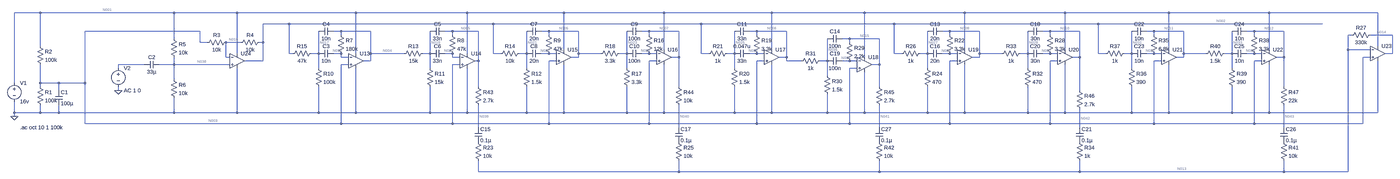
[diagram p0: schematic Implemented_Equalizer.asc, whole sheet]
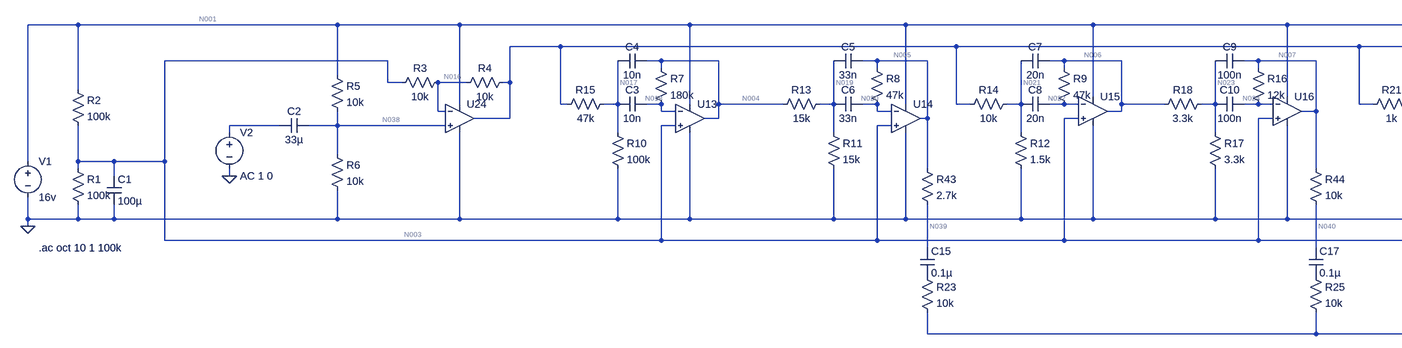
[diagram p1: schematic Implemented_Equalizer.asc, part, row 1 of 1, column 1 of 2]
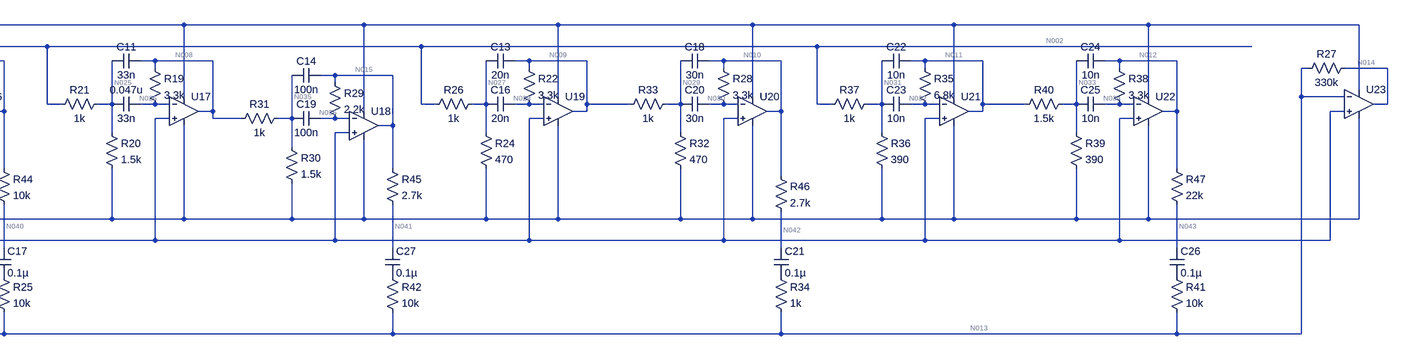
[diagram p2: schematic Implemented_Equalizer.asc, part, row 1 of 1, column 2 of 2]
Implemented_Equalizer.asc, the LTspice schematic file:
Version 4
SHEET 1 5168 1268
WIRE -912 -176 -1024 -176
WIRE -336 -176 -912 -176
WIRE -64 -176 -336 -176
WIRE 448 -176 -64 -176
WIRE 928 -176 448 -176
WIRE 1344 -176 928 -176
WIRE 1776 -176 1344 -176
WIRE 2240 -176 1776 -176
WIRE 2640 -176 2240 -176
WIRE 3072 -176 2640 -176
WIRE 3504 -176 3072 -176
WIRE 3952 -176 3504 -176
WIRE 4384 -176 3952 -176
WIRE 4944 -176 4384 -176
WIRE 160 -128 48 -128
WIRE 1040 -128 160 -128
WIRE 1936 -128 1040 -128
WIRE 2768 -128 1936 -128
WIRE 3648 -128 2768 -128
WIRE 4704 -128 3648 -128
WIRE -224 -96 -720 -96
WIRE 384 -96 352 -96
WIRE 512 -96 384 -96
WIRE 864 -96 832 -96
WIRE 976 -96 864 -96
WIRE 1280 -96 1248 -96
WIRE 1408 -96 1280 -96
WIRE 1712 -96 1680 -96
WIRE 1840 -96 1712 -96
WIRE 2176 -96 2144 -96
WIRE 2304 -96 2176 -96
WIRE 3008 -96 2976 -96
WIRE 3136 -96 3008 -96
WIRE 3440 -96 3408 -96
WIRE 3568 -96 3440 -96
WIRE 3888 -96 3856 -96
WIRE 4016 -96 3888 -96
WIRE 4320 -96 4288 -96
WIRE 4448 -96 4320 -96
WIRE 384 -80 384 -96
WIRE 864 -80 864 -96
WIRE 1280 -80 1280 -96
WIRE 1712 -80 1712 -96
WIRE 2176 -80 2176 -96
WIRE 3008 -80 3008 -96
WIRE 3440 -80 3440 -96
WIRE 3888 -80 3888 -96
WIRE 4320 -80 4320 -96
WIRE 4832 -80 4816 -80
WIRE 5008 -80 4912 -80
WIRE -336 -64 -336 -176
WIRE 2576 -64 2544 -64
WIRE 2704 -64 2576 -64
WIRE -224 -48 -224 -96
WIRE -192 -48 -224 -48
WIRE -48 -48 -112 -48
WIRE 48 -48 48 -128
WIRE 48 -48 32 -48
WIRE 2576 -48 2576 -64
WIRE -912 -32 -912 -176
WIRE 4944 -32 4944 -176
WIRE 1344 -16 1344 -176
WIRE 1776 -16 1776 -176
WIRE 2240 -16 2240 -176
WIRE 3072 -16 3072 -176
WIRE 3504 -16 3504 -176
WIRE 3952 -16 3952 -176
WIRE 4384 -16 4384 -176
WIRE 4816 -16 4816 -80
WIRE 4912 -16 4816 -16
WIRE -64 0 -64 -176
WIRE 160 0 160 -128
WIRE 176 0 160 0
WIRE 288 0 288 -96
WIRE 288 0 256 0
WIRE 384 0 352 0
WIRE 448 0 448 -176
WIRE 512 0 512 -96
WIRE 656 0 512 0
WIRE 768 0 768 -96
WIRE 768 0 736 0
WIRE 864 0 832 0
WIRE 928 0 928 -176
WIRE 1040 0 1040 -128
WIRE 1072 0 1040 0
WIRE 1184 0 1184 -96
WIRE 1184 0 1152 0
WIRE 1280 0 1248 0
WIRE 1312 0 1280 0
WIRE 1408 0 1408 -96
WIRE 1504 0 1408 0
WIRE 1616 0 1616 -96
WIRE 1616 0 1584 0
WIRE 1712 0 1680 0
WIRE 1744 0 1712 0
WIRE 1936 0 1936 -128
WIRE 1968 0 1936 0
WIRE 2080 0 2080 -96
WIRE 2080 0 2048 0
WIRE 2176 0 2144 0
WIRE 2208 0 2176 0
WIRE 2768 0 2768 -128
WIRE 2800 0 2768 0
WIRE 2912 0 2912 -96
WIRE 2912 0 2880 0
WIRE 3008 0 2976 0
WIRE 3040 0 3008 0
WIRE 3136 0 3136 -96
WIRE 3232 0 3136 0
WIRE 3344 0 3344 -96
WIRE 3344 0 3312 0
WIRE 3440 0 3408 0
WIRE 3472 0 3440 0
WIRE 3648 0 3648 -128
WIRE 3680 0 3648 0
WIRE 3792 0 3792 -96
WIRE 3792 0 3760 0
WIRE 3888 0 3856 0
WIRE 3920 0 3888 0
WIRE 4016 0 4016 -96
WIRE 4112 0 4016 0
WIRE 4224 0 4224 -96
WIRE 4224 0 4192 0
WIRE 4320 0 4288 0
WIRE 4352 0 4320 0
WIRE 5008 0 5008 -80
WIRE 5008 0 4976 0
WIRE -112 16 -112 -48
WIRE -96 16 -112 16
WIRE 384 16 384 0
WIRE 416 16 384 16
WIRE 864 16 864 0
WIRE 896 16 864 16
WIRE 1408 16 1408 0
WIRE 1408 16 1376 16
WIRE 1840 16 1840 -96
WIRE 1840 16 1808 16
WIRE 2304 16 2304 -96
WIRE 2304 16 2272 16
WIRE 2640 16 2640 -176
WIRE 3136 16 3136 0
WIRE 3136 16 3104 16
WIRE 3568 16 3568 -96
WIRE 3568 16 3536 16
WIRE 4016 16 4016 0
WIRE 4016 16 3984 16
WIRE 4448 16 4448 -96
WIRE 4448 16 4416 16
WIRE 4912 16 4880 16
WIRE 48 32 48 -48
WIRE 48 32 -32 32
WIRE 512 32 512 0
WIRE 512 32 480 32
WIRE 976 32 976 -96
WIRE 976 32 960 32
WIRE 1312 32 1280 32
WIRE 1744 32 1712 32
WIRE 2208 32 2176 32
WIRE 2304 32 2304 16
WIRE 2368 32 2304 32
WIRE 2480 32 2480 -64
WIRE 2480 32 2448 32
WIRE 2576 32 2544 32
WIRE 2608 32 2576 32
WIRE 3040 32 3008 32
WIRE 3472 32 3440 32
WIRE 3920 32 3888 32
WIRE 4352 32 4320 32
WIRE -464 48 -576 48
WIRE -336 48 -336 16
WIRE -336 48 -400 48
WIRE -96 48 -336 48
WIRE 416 48 384 48
WIRE 896 48 864 48
WIRE 2704 48 2704 -64
WIRE 2704 48 2672 48
WIRE -576 64 -576 48
WIRE 288 64 288 0
WIRE 768 64 768 0
WIRE 1184 64 1184 0
WIRE 1616 64 1616 0
WIRE 2080 64 2080 0
WIRE 2608 64 2576 64
WIRE 2912 64 2912 0
WIRE 3344 64 3344 0
WIRE 3792 64 3792 0
WIRE 4224 64 4224 0
WIRE 2480 96 2480 32
WIRE -336 112 -336 48
WIRE -1024 128 -1024 -176
WIRE -912 128 -912 48
WIRE -832 128 -912 128
WIRE -720 128 -720 -96
WIRE -720 128 -832 128
WIRE -912 144 -912 128
WIRE 976 144 976 32
WIRE 1840 144 1840 16
WIRE 2704 144 2704 48
WIRE 4448 144 4448 16
WIRE -832 160 -832 128
WIRE -576 160 -576 144
WIRE 3568 160 3568 16
WIRE -1024 256 -1024 208
WIRE -912 256 -912 224
WIRE -912 256 -1024 256
WIRE -832 256 -832 224
WIRE -832 256 -912 256
WIRE -336 256 -336 192
WIRE -336 256 -832 256
WIRE -64 256 -64 64
WIRE -64 256 -336 256
WIRE 288 256 288 144
WIRE 288 256 -64 256
WIRE 448 256 448 64
WIRE 448 256 288 256
WIRE 768 256 768 144
WIRE 768 256 448 256
WIRE 928 256 928 64
WIRE 928 256 768 256
WIRE 1184 256 1184 144
WIRE 1184 256 928 256
WIRE 1344 256 1344 48
WIRE 1344 256 1184 256
WIRE 1616 256 1616 144
WIRE 1616 256 1344 256
WIRE 1776 256 1776 48
WIRE 1776 256 1616 256
WIRE 2080 256 2080 144
WIRE 2080 256 1776 256
WIRE 2240 256 2240 48
WIRE 2240 256 2080 256
WIRE 2480 256 2480 176
WIRE 2480 256 2240 256
WIRE 2640 256 2640 80
WIRE 2640 256 2480 256
WIRE 2912 256 2912 144
WIRE 2912 256 2640 256
WIRE 3072 256 3072 48
WIRE 3072 256 2912 256
WIRE 3344 256 3344 144
WIRE 3344 256 3072 256
WIRE 3504 256 3504 48
WIRE 3504 256 3344 256
WIRE 3792 256 3792 144
WIRE 3792 256 3504 256
WIRE 3952 256 3952 48
WIRE 3952 256 3792 256
WIRE 4224 256 4224 144
WIRE 4224 256 3952 256
WIRE 4384 256 4384 48
WIRE 4384 256 4224 256
WIRE 4944 256 4944 32
WIRE 4944 256 4384 256
WIRE -1024 272 -1024 256
WIRE -720 304 -720 128
WIRE 384 304 384 48
WIRE 384 304 -720 304
WIRE 864 304 864 48
WIRE 864 304 384 304
WIRE 1280 304 1280 32
WIRE 1280 304 864 304
WIRE 1712 304 1712 32
WIRE 1712 304 1280 304
WIRE 2176 304 2176 32
WIRE 2176 304 1712 304
WIRE 2576 304 2576 64
WIRE 2576 304 2176 304
WIRE 3008 304 3008 32
WIRE 3008 304 2576 304
WIRE 3440 304 3440 32
WIRE 3440 304 3008 304
WIRE 3888 304 3888 32
WIRE 3888 304 3440 304
WIRE 4320 304 4320 32
WIRE 4320 304 3888 304
WIRE 4880 304 4880 16
WIRE 4880 304 4320 304
WIRE 976 320 976 224
WIRE 1840 320 1840 224
WIRE 2704 320 2704 224
WIRE 3568 320 3568 240
WIRE 4448 320 4448 224
WIRE 976 512 976 464
WIRE 1840 512 1840 464
WIRE 1840 512 976 512
WIRE 2704 512 2704 464
WIRE 2704 512 1840 512
WIRE 3568 512 3568 464
WIRE 3568 512 2704 512
WIRE 4448 512 4448 464
WIRE 4448 512 3568 512
WIRE 4816 512 4816 -16
WIRE 4816 512 4448 512
FLAG -1024 272 0
FLAG -576 160 0
SYMBOL voltage -1024 112 R0
WINDOW 123 0 0 Left 0
WINDOW 39 0 0 Left 0
SYMATTR InstName V1
SYMATTR Value 16v
SYMBOL res -928 128 R0
SYMATTR InstName R1
SYMATTR Value 100k
SYMBOL res -928 -48 R0
SYMATTR InstName R2
SYMATTR Value 100k
SYMBOL cap -848 160 R0
SYMATTR InstName C1
SYMATTR Value 100µ
SYMBOL res -96 -64 R90
WINDOW 0 0 56 VBottom 2
WINDOW 3 32 56 VTop 2
SYMATTR InstName R3
SYMATTR Value 10k
SYMBOL res 48 -64 R90
WINDOW 0 0 56 VBottom 2
WINDOW 3 32 56 VTop 2
SYMATTR InstName R4
SYMATTR Value 10k
SYMBOL res -352 -80 R0
SYMATTR InstName R5
SYMATTR Value 10k
SYMBOL res -352 96 R0
SYMATTR InstName R6
SYMATTR Value 10k
SYMBOL cap -400 32 R90
WINDOW 0 0 32 VBottom 2
WINDOW 3 32 32 VTop 2
SYMATTR InstName C2
SYMATTR Value 33µ
SYMBOL voltage -576 48 R0
WINDOW 123 24 112 Left 2
WINDOW 39 0 0 Left 0
SYMATTR Value2 AC 1 0
SYMATTR InstName V2
SYMATTR Value ""
SYMBOL res 368 -96 R0
SYMATTR InstName R7
SYMATTR Value 180k
SYMBOL res 848 -96 R0
SYMATTR InstName R8
SYMATTR Value 47k
SYMBOL res 1264 -96 R0
SYMATTR InstName R9
SYMATTR Value 47k
SYMBOL cap 352 -16 R90
WINDOW 0 0 32 VBottom 2
WINDOW 3 32 32 VTop 2
SYMATTR InstName C3
SYMATTR Value 10n
SYMBOL cap 352 -112 R90
WINDOW 0 0 32 VBottom 2
WINDOW 3 32 32 VTop 2
SYMATTR InstName C4
SYMATTR Value 10n
SYMBOL cap 832 -112 R90
WINDOW 0 0 32 VBottom 2
WINDOW 3 32 32 VTop 2
SYMATTR InstName C5
SYMATTR Value 33n
SYMBOL cap 832 -16 R90
WINDOW 0 0 32 VBottom 2
WINDOW 3 32 32 VTop 2
SYMATTR InstName C6
SYMATTR Value 33n
SYMBOL cap 1248 -112 R90
WINDOW 0 0 32 VBottom 2
WINDOW 3 32 32 VTop 2
SYMATTR InstName C7
SYMATTR Value 20n
SYMBOL cap 1248 -16 R90
WINDOW 0 0 32 VBottom 2
WINDOW 3 32 32 VTop 2
SYMATTR InstName C8
SYMATTR Value 20n
SYMBOL res 272 48 R0
SYMATTR InstName R10
SYMATTR Value 100k
SYMBOL res 752 48 R0
SYMATTR InstName R11
SYMATTR Value 15k
SYMBOL res 1168 48 R0
SYMATTR InstName R12
SYMATTR Value 1.5k
SYMBOL res 752 -16 R90
WINDOW 0 0 56 VBottom 2
WINDOW 3 32 56 VTop 2
SYMATTR InstName R13
SYMATTR Value 15k
SYMBOL res 1168 -16 R90
WINDOW 0 0 56 VBottom 2
WINDOW 3 32 56 VTop 2
SYMATTR InstName R14
SYMATTR Value 10k
SYMBOL res 272 -16 R90
WINDOW 0 0 56 VBottom 2
WINDOW 3 32 56 VTop 2
SYMATTR InstName R15
SYMATTR Value 47k
SYMBOL res 1696 -96 R0
SYMATTR InstName R16
SYMATTR Value 12k
SYMBOL cap 1680 -112 R90
WINDOW 0 0 32 VBottom 2
WINDOW 3 32 32 VTop 2
SYMATTR InstName C9
SYMATTR Value 100n
SYMBOL cap 1680 -16 R90
WINDOW 0 0 32 VBottom 2
WINDOW 3 32 32 VTop 2
SYMATTR InstName C10
SYMATTR Value 100n
SYMBOL res 1600 48 R0
SYMATTR InstName R17
SYMATTR Value 3.3k
SYMBOL res 1600 -16 R90
WINDOW 0 0 56 VBottom 2
WINDOW 3 32 56 VTop 2
SYMATTR InstName R18
SYMATTR Value 3.3k
SYMBOL res 2160 -96 R0
SYMATTR InstName R19
SYMATTR Value 3.3k
SYMBOL cap 2144 -112 R90
WINDOW 0 0 32 VBottom 2
WINDOW 3 32 32 VTop 2
SYMATTR InstName C11
SYMATTR Value 33n
SYMBOL cap 2144 -16 R90
WINDOW 0 0 32 VBottom 2
WINDOW 3 32 32 VTop 2
SYMATTR InstName 0.047u
SYMATTR Value 33n
SYMBOL res 2064 48 R0
SYMATTR InstName R20
SYMATTR Value 1.5k
SYMBOL res 2064 -16 R90
WINDOW 0 0 56 VBottom 2
WINDOW 3 32 56 VTop 2
SYMATTR InstName R21
SYMATTR Value 1k
SYMBOL cap 960 320 R0
SYMATTR InstName C15
SYMATTR Value 0.1µ
SYMBOL cap 1824 320 R0
SYMATTR InstName C17
SYMATTR Value 0.1µ
SYMBOL res 960 368 R0
SYMATTR InstName R23
SYMATTR Value 10k
SYMBOL res 1824 368 R0
SYMATTR InstName R25
SYMATTR Value 10k
SYMBOL res 4928 -96 R90
WINDOW 0 0 56 VBottom 2
WINDOW 3 32 56 VTop 2
SYMATTR InstName R27
SYMATTR Value 330k
SYMBOL res 2560 -64 R0
SYMATTR InstName R29
SYMATTR Value 2.2k
SYMBOL cap 2544 -80 R90
WINDOW 0 0 32 VBottom 2
WINDOW 3 32 32 VTop 2
SYMATTR InstName C14
SYMATTR Value 100n
SYMBOL cap 2544 16 R90
WINDOW 0 0 32 VBottom 2
WINDOW 3 32 32 VTop 2
SYMATTR InstName C19
SYMATTR Value 100n
SYMBOL res 2464 80 R0
SYMATTR InstName R30
SYMATTR Value 1.5k
SYMBOL res 2464 16 R90
WINDOW 0 0 56 VBottom 2
WINDOW 3 32 56 VTop 2
SYMATTR InstName R31
SYMATTR Value 1k
SYMBOL res 2992 -96 R0
SYMATTR InstName R22
SYMATTR Value 3.3k
SYMBOL cap 2976 -112 R90
WINDOW 0 0 32 VBottom 2
WINDOW 3 32 32 VTop 2
SYMATTR InstName C13
SYMATTR Value 20n
SYMBOL cap 2976 -16 R90
WINDOW 0 0 32 VBottom 2
WINDOW 3 32 32 VTop 2
SYMATTR InstName C16
SYMATTR Value 20n
SYMBOL res 2896 48 R0
SYMATTR InstName R24
SYMATTR Value 470
SYMBOL res 2896 -16 R90
WINDOW 0 0 56 VBottom 2
WINDOW 3 32 56 VTop 2
SYMATTR InstName R26
SYMATTR Value 1k
SYMBOL res 3424 -96 R0
SYMATTR InstName R28
SYMATTR Value 3.3k
SYMBOL cap 3408 -112 R90
WINDOW 0 0 32 VBottom 2
WINDOW 3 32 32 VTop 2
SYMATTR InstName C18
SYMATTR Value 30n
SYMBOL cap 3408 -16 R90
WINDOW 0 0 32 VBottom 2
WINDOW 3 32 32 VTop 2
SYMATTR InstName C20
SYMATTR Value 30n
SYMBOL res 3328 48 R0
SYMATTR InstName R32
SYMATTR Value 470
SYMBOL res 3328 -16 R90
WINDOW 0 0 56 VBottom 2
WINDOW 3 32 56 VTop 2
SYMATTR InstName R33
SYMATTR Value 1k
SYMBOL cap 3552 320 R0
SYMATTR InstName C21
SYMATTR Value 0.1µ
SYMBOL res 3552 368 R0
SYMATTR InstName R34
SYMATTR Value 1k
SYMBOL res 3872 -96 R0
SYMATTR InstName R35
SYMATTR Value 6.8k
SYMBOL cap 3856 -112 R90
WINDOW 0 0 32 VBottom 2
WINDOW 3 32 32 VTop 2
SYMATTR InstName C22
SYMATTR Value 10n
SYMBOL cap 3856 -16 R90
WINDOW 0 0 32 VBottom 2
WINDOW 3 32 32 VTop 2
SYMATTR InstName C23
SYMATTR Value 10n
SYMBOL res 3776 48 R0
SYMATTR InstName R36
SYMATTR Value 390
SYMBOL res 3776 -16 R90
WINDOW 0 0 56 VBottom 2
WINDOW 3 32 56 VTop 2
SYMATTR InstName R37
SYMATTR Value 1k
SYMBOL res 4304 -96 R0
SYMATTR InstName R38
SYMATTR Value 3.3k
SYMBOL cap 4288 -112 R90
WINDOW 0 0 32 VBottom 2
WINDOW 3 32 32 VTop 2
SYMATTR InstName C24
SYMATTR Value 10n
SYMBOL cap 4288 -16 R90
WINDOW 0 0 32 VBottom 2
WINDOW 3 32 32 VTop 2
SYMATTR InstName C25
SYMATTR Value 10n
SYMBOL res 4208 48 R0
SYMATTR InstName R39
SYMATTR Value 390
SYMBOL res 4208 -16 R90
WINDOW 0 0 56 VBottom 2
WINDOW 3 32 56 VTop 2
SYMATTR InstName R40
SYMATTR Value 1.5k
SYMBOL cap 4432 320 R0
SYMATTR InstName C26
SYMATTR Value 0.1µ
SYMBOL res 4432 368 R0
SYMATTR InstName R41
SYMATTR Value 10k
SYMBOL cap 2688 320 R0
SYMATTR InstName C27
SYMATTR Value 0.1µ
SYMBOL res 2688 368 R0
SYMATTR InstName R42
SYMATTR Value 10k
SYMBOL OpAmps\\UniversalOpAmp 448 32 R0
SYMATTR InstName U13
SYMBOL OpAmps\\UniversalOpAmp 928 32 R0
SYMATTR InstName U14
SYMBOL OpAmps\\UniversalOpAmp 1344 16 R0
SYMATTR InstName U15
SYMBOL OpAmps\\UniversalOpAmp 1776 16 R0
SYMATTR InstName U16
SYMBOL OpAmps\\UniversalOpAmp 2240 16 R0
SYMATTR InstName U17
SYMBOL OpAmps\\UniversalOpAmp 2640 48 R0
SYMATTR InstName U18
SYMBOL OpAmps\\UniversalOpAmp 3072 16 R0
SYMATTR InstName U19
SYMBOL OpAmps\\UniversalOpAmp 3504 16 R0
SYMATTR InstName U20
SYMBOL OpAmps\\UniversalOpAmp 3952 16 R0
SYMATTR InstName U21
SYMBOL OpAmps\\UniversalOpAmp 4384 16 R0
SYMATTR InstName U22
SYMBOL OpAmps\\UniversalOpAmp 4944 0 R0
SYMATTR InstName U23
SYMBOL OpAmps\\UniversalOpAmp -64 32 R0
SYMATTR InstName U24
SYMBOL res 960 128 R0
SYMATTR InstName R43
SYMATTR Value 2.7k
SYMBOL res 1824 128 R0
SYMATTR InstName R44
SYMATTR Value 10k
SYMBOL res 2688 128 R0
SYMATTR InstName R45
SYMATTR Value 2.7k
SYMBOL res 3552 144 R0
SYMATTR InstName R46
SYMATTR Value 2.7k
SYMBOL res 4432 128 R0
SYMATTR InstName R47
SYMATTR Value 22k
TEXT -1000 320 Left 2 !.ac oct 10 1 100k

The netlist it stands for:
* Implemented_Equalizer.asc
V1 N001 0 16v
R1 N003 0 100k
R2 N001 N003 100k
C1 N003 0 100µ
R3 N016 N003 10k
R4 N002 N016 10k
R5 N001 N038 10k
R6 N038 0 10k
C2 N038 N037 33µ
V2 N037 0 AC 1 0
R7 N004 N018 180k
R8 N005 N020 47k
R9 N006 N022 47k
C3 N018 N017 10n
C4 N004 N017 10n
C5 N005 N019 33n
C6 N020 N019 33n
C7 N006 N021 20n
C8 N022 N021 20n
R10 N017 0 100k
R11 N019 0 15k
R12 N021 0 1.5k
R13 N019 N004 15k
R14 N021 N002 10k
R15 N017 N002 47k
R16 N007 N024 12k
C9 N007 N023 100n
C10 N024 N023 100n
R17 N023 0 3.3k
R18 N023 N006 3.3k
R19 N008 N026 3.3k
C11 N008 N025 33n
C§0.047u N026 N025 33n
R20 N025 0 1.5k
R21 N025 N002 1k
C15 N039 P001 0.1µ
C17 N040 P002 0.1µ
R23 P001 N013 10k
R25 P002 N013 10k
R27 N014 N013 330k
R29 N015 N036 2.2k
C14 N015 N035 100n
C19 N036 N035 100n
R30 N035 0 1.5k
R31 N035 N008 1k
R22 N009 N028 3.3k
C13 N009 N027 20n
C16 N028 N027 20n
R24 N027 0 470
R26 N027 N002 1k
R28 N010 N030 3.3k
C18 N010 N029 30n
C20 N030 N029 30n
R32 N029 0 470
R33 N029 N009 1k
C21 N042 P003 0.1µ
R34 P003 N013 1k
R35 N011 N032 6.8k
C22 N011 N031 10n
C23 N032 N031 10n
R36 N031 0 390
R37 N031 N002 1k
R38 N012 N034 3.3k
C24 N012 N033 10n
C25 N034 N033 10n
R39 N033 0 390
R40 N033 N011 1.5k
C26 N043 P004 0.1µ
R41 P004 N013 10k
C27 N041 P005 0.1µ
R42 P005 N013 10k
XU13 N003 N018 N001 0 N004 level1 Avol=1Meg GBW=10Meg Vos=0 En=0 Enk=0 In=0 Ink=0 Rin=500Meg  ; pins In+ In- V+ V- OUT
XU14 N003 N020 N001 0 N005 level1 Avol=1Meg GBW=10Meg Vos=0 En=0 Enk=0 In=0 Ink=0 Rin=500Meg  ; pins In+ In- V+ V- OUT
XU15 N003 N022 N001 0 N006 level1 Avol=1Meg GBW=10Meg Vos=0 En=0 Enk=0 In=0 Ink=0 Rin=500Meg  ; pins In+ In- V+ V- OUT
XU16 N003 N024 N001 0 N007 level1 Avol=1Meg GBW=10Meg Vos=0 En=0 Enk=0 In=0 Ink=0 Rin=500Meg  ; pins In+ In- V+ V- OUT
XU17 N003 N026 N001 0 N008 level1 Avol=1Meg GBW=10Meg Vos=0 En=0 Enk=0 In=0 Ink=0 Rin=500Meg  ; pins In+ In- V+ V- OUT
XU18 N003 N036 N001 0 N015 level1 Avol=1Meg GBW=10Meg Vos=0 En=0 Enk=0 In=0 Ink=0 Rin=500Meg  ; pins In+ In- V+ V- OUT
XU19 N003 N028 N001 0 N009 level1 Avol=1Meg GBW=10Meg Vos=0 En=0 Enk=0 In=0 Ink=0 Rin=500Meg  ; pins In+ In- V+ V- OUT
XU20 N003 N030 N001 0 N010 level1 Avol=1Meg GBW=10Meg Vos=0 En=0 Enk=0 In=0 Ink=0 Rin=500Meg  ; pins In+ In- V+ V- OUT
XU21 N003 N032 N001 0 N011 level1 Avol=1Meg GBW=10Meg Vos=0 En=0 Enk=0 In=0 Ink=0 Rin=500Meg  ; pins In+ In- V+ V- OUT
XU22 N003 N034 N001 0 N012 level1 Avol=1Meg GBW=10Meg Vos=0 En=0 Enk=0 In=0 Ink=0 Rin=500Meg  ; pins In+ In- V+ V- OUT
XU23 N003 N013 N001 0 N014 level1 Avol=1Meg GBW=10Meg Vos=0 En=0 Enk=0 In=0 Ink=0 Rin=500Meg  ; pins In+ In- V+ V- OUT
XU24 N038 N016 N001 0 N002 level1 Avol=1Meg GBW=10Meg Vos=0 En=0 Enk=0 In=0 Ink=0 Rin=500Meg  ; pins In+ In- V+ V- OUT
R43 N005 N039 2.7k
R44 N007 N040 10k
R45 N015 N041 2.7k
R46 N010 N042 2.7k
R47 N012 N043 22k
.ac oct 10 1 100k
.lib UniversalOpAmp1.lib
.backanno
.end

* Results of the author's LTspice run, read from the files saved beside the schematic
* Operating Point, zero values left out:
*   V(n001) = 16 V
*   V(n003) = 8 V
*   V(n016) = 8 V
*   V(n002) = 8 V
*   V(n038) = 8 V
*   V(n004) = 8 V
*   V(n018) = 8 V
*   V(n005) = 8 V
*   V(n020) = 8 V
*   V(n006) = 8 V
*   V(n022) = 8 V
*   V(n017) = 5.442 V
*   V(n019) = 4 V
*   V(n021) = 1.043 V
*   V(n007) = 8 V
*   V(n024) = 8 V
*   V(n023) = 4 V
*   V(n008) = 8 V
*   V(n026) = 8 V
*   V(n025) = 4.8 V
*   V(n039) = 8 V
*   V(p001) = 8 V
*   V(n040) = 8 V
*   V(p002) = 8 V
*   V(n013) = 8 V
*   V(n014) = 8 V
*   V(n015) = 8 V
*   V(n036) = 8 V
*   V(n035) = 4.8 V
*   V(n009) = 8 V
*   V(n028) = 8 V
*   V(n027) = 2.558 V
*   V(n010) = 8 V
*   V(n030) = 8 V
*   V(n029) = 2.558 V
*   V(n042) = 8 V
*   V(p003) = 8 V
*   V(n011) = 8 V
*   V(n032) = 8 V
*   V(n031) = 2.245 V
*   V(n012) = 8 V
*   V(n034) = 8 V
*   V(n033) = 1.651 V
*   V(n043) = 8 V
*   V(p004) = 8 V
*   V(n041) = 8 V
*   V(p005) = 8 V
*   I(R1) = 80 µA
*   I(R2) = 80 µA
*   I(R3) = -133.5 pA
*   I(R4) = -133.6 pA
*   I(R5) = 800 µA
*   I(R6) = 800 µA
*   I(R10) = 54.42 µA
*   I(R11) = 266.7 µA
*   I(R12) = 695.7 µA
*   I(R13) = -266.7 µA
*   I(R14) = -695.7 µA
*   I(R15) = -54.42 µA
*   I(R17) = 1.212 mA
*   I(R18) = -1.212 mA
*   I(R20) = 3.2 mA
*   I(R21) = -3.2 mA
*   I(R30) = 3.2 mA
*   I(R31) = -3.2 mA
*   I(R24) = 5.442 mA
*   I(R26) = -5.442 mA
*   I(R32) = 5.442 mA
*   I(R33) = -5.442 mA
*   I(R36) = 5.755 mA
*   I(R37) = -5.755 mA
*   I(R39) = 4.233 mA
*   I(R40) = -4.233 mA
*   I(V1) = -880.2 µA
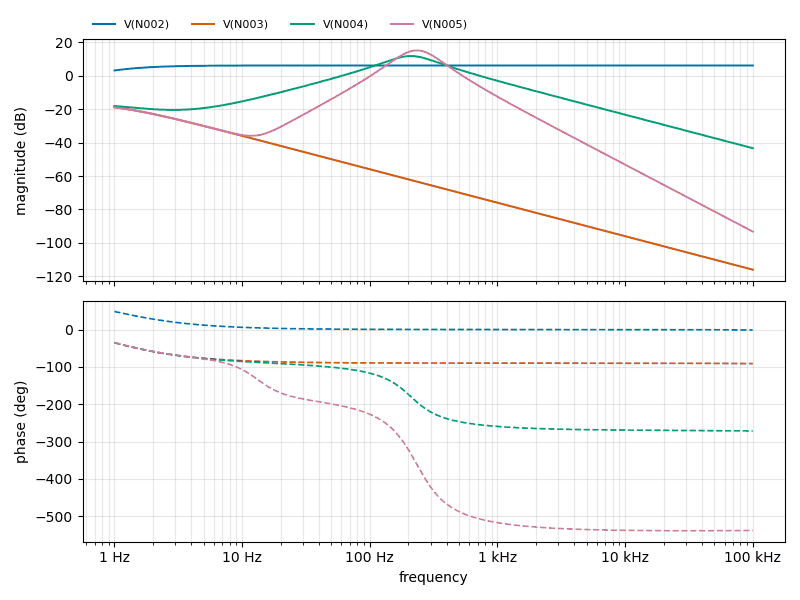
[diagram p3: AC Analysis of Implemented_Equalizer.asc, plotted from the saved traces]
* AC Analysis, 1 run:
*   V(N002): 3.06 dB at 1 Hz, 6.02 dB at 100 kHz, peak 6.02 dB at 2.195 kHz
*   V(N003): -18.98 dB at 1 Hz, -115.97 dB at 100 kHz, peak -18.98 dB at 1 Hz, 3 dB below the peak at 1.739 Hz
*   V(N004): -18.17 dB at 1 Hz, -43.39 dB at 100 kHz, peak 11.66 dB at 207.9 Hz, 3 dB below the peak at 139.2 Hz and 316.1 Hz
*   V(N005): -18.97 dB at 1 Hz, -93.22 dB at 100 kHz, peak 15.03 dB at 238.9 Hz, 3 dB below the peak at 176.5 Hz and 307.7 Hz